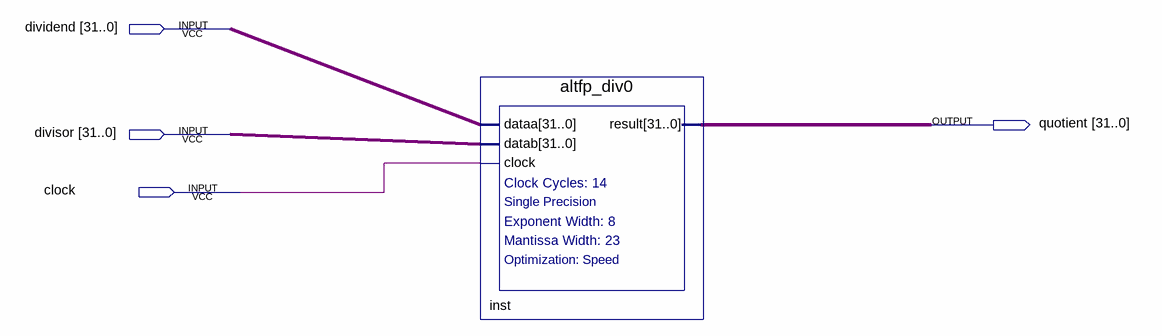
[diagram p0: schematic sheet]
// Quartus schematic norfleet.bdf as structural Verilog: 1 symbols, 4 pins
module norfleet (
  input  [31:0] dividend,
  input  [31:0] divisor,
  input  clock,
  output [31:0] quotient
);

  altfp_div0 inst (.dataa(dividend), .datab(divisor), .clock(clock), .result(quotient));
endmodule
